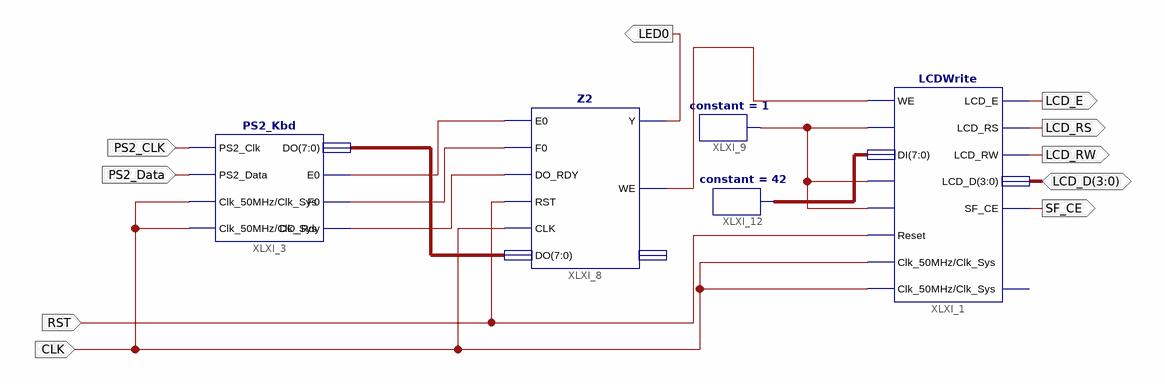
[diagram p0: schematic sheet 1]
// Xilinx ISE schematic Z2_Schemat.sch (spartan3e) as structural Verilog: 5 symbols, 10 ports
module Z2_Schemat (
  input  CLK,
  input  RST,
  input  PS2_CLK,
  input  PS2_Data,
  inout  [3:0] LCD_D,
  output LED0,
  output LCD_E,
  output LCD_RS,
  output LCD_RW,
  output SF_CE
);

  wire XLXN_2, XLXN_3, XLXN_4, XLXN_24, XLXN_31;
  wire [7:0] XLXN_1, XLXN_29;

  LCDWrite XLXI_1 (
    .WE(XLXN_31), .DnI(XLXN_24), .Reset(RST), .Cursor(XLXN_24), .Blink(XLXN_24), .DI(XLXN_29), .LCD_E(LCD_E),
    .LCD_RS(LCD_RS), .LCD_RW(LCD_RW), .LCD_D(LCD_D), .SF_CE(SF_CE), .Clk_50MHz(CLK), .Clk_Sys(CLK));  // open: Busy
  PS2_Kbd XLXI_3 (
    .PS2_Clk(PS2_CLK), .PS2_Data(PS2_Data), .Clk_50MHz(CLK), .E0(XLXN_2), .F0(XLXN_3), .DO_Rdy(XLXN_4),
    .DO(XLXN_1), .Clk_Sys(CLK));
  Z2 XLXI_8 (
    .E0(XLXN_2), .F0(XLXN_3), .DO_RDY(XLXN_4), .RST(RST), .CLK(CLK), .DO(XLXN_1), .Y(LED0), .WE(XLXN_31));  // open: D
  constant #(.CValue("1")) XLXI_9 (.O(XLXN_24));
  constant #(.CValue("42")) XLXI_12 (.O(XLXN_29));
endmodule
